# EAGLE schematic meio (EAGLE 9.6.2)
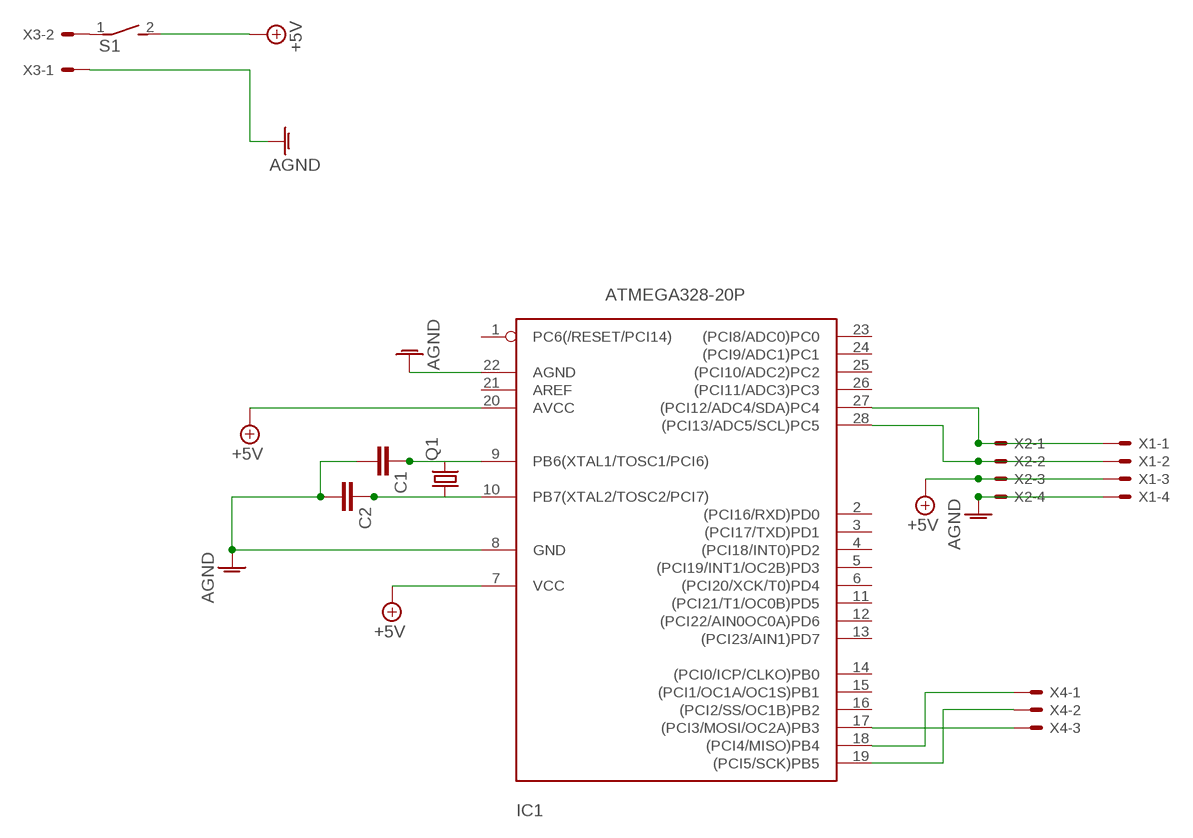
[diagram p0: schematic, sheet 1]

## Parts
C1  C-EU025-025X050  [C025-025X050]
C2  C-EU025-025X050  [C025-025X050]
IC1  ATMEGA328-20P  [DIL28-3]
Q1  CRYSTALHC49S  [HC49/S]
S1  DS01E  [DS-01]
X1  KK-156-4  [KK-156-4]
X2  KK-156-4  [KK-156-4]
X3  KK-156-2  [KK-156-2]
X4  KK-156-3  [KK-156-3]

## Nets
+5V: IC1.7(VCC) IC1.20(AVCC) S1.2 X1.3 X2.3
AGND: C1.2 C2.2 IC1.8(GND) IC1.22(AGND) X1.4 X2.4 X3.1
N$1: C1.1 IC1.9(PB6(XTAL1/TOSC1/PCI6)) Q1.2
N$2: C2.1 IC1.10(PB7(XTAL2/TOSC2/PCI7)) Q1.1
N$3: IC1.27((PCI12/ADC4/SDA)PC4) X1.1 X2.1
N$4: IC1.28((PCI13/ADC5/SCL)PC5) X1.2 X2.2
N$5: S1.1 X3.2
N$6: IC1.18((PCI4/MISO)PB4) X4.1
N$7: IC1.19((PCI5/SCK)PB5) X4.2
N$8: IC1.17((PCI3/MOSI/OC2A)PB3) X4.3
Unconnected: IC1.1(PC6(/RESET/PCI14)) IC1.2((PCI16/RXD)PD0) IC1.3((PCI17/TXD)PD1) IC1.4((PCI18/INT0)PD2) IC1.5((PCI19/INT1/OC2B)PD3) IC1.6((PCI20/XCK/T0)PD4) IC1.11((PCI21/T1/OC0B)PD5) IC1.12((PCI22/AIN0OC0A)PD6) IC1.13((PCI23/AIN1)PD7) IC1.14((PCI0/ICP/CLKO)PB0) IC1.15((PCI1/OC1A/OC1S)PB1) IC1.16((PCI2/SS/OC1B)PB2) IC1.21(AREF) IC1.23((PCI8/ADC0)PC0) IC1.24((PCI9/ADC1)PC1) IC1.25((PCI10/ADC2)PC2) IC1.26((PCI11/ADC3)PC3)

## Library data of the parts
C1 C2 = rcl:C-EU: CAPACITOR, European symbol; SPICEPREFIX: C
IC1 = ATMEGA328P:ATMEGA328*P: MICROCONTROLLER 32 kBytes FLASH 2 kBytes SRAM 1 kBytes EEPROM USART 8-channel 10 bit ADC
Q1 = crystal:CRYSTAL: CRYSTAL; OC_FARNELL: 1667008; OC_NEWARK: unknown
S1 = switch-dil:DS01E: DIL/CODE SWITCH; OC_FARNELL: unknown; OC_NEWARK: unknown
X1 X2 = con-molex:KK-156-4: KK 156 HEADER Source: http://www.molex.com/pdm_docs/sd/026604100_sd.pdf; MF: MOLEX; OC_FARNELL: unknown; OC_NEWARK: unknown
X3 = con-molex:KK-156-2: KK 156 HEADER Source: http://www.molex.com/pdm_docs/sd/026604100_sd.pdf; MF: MOLEX; OC_FARNELL: unknown; OC_NEWARK: unknown
X4 = con-molex:KK-156-3: KK 156 HEADER Source: http://www.molex.com/pdm_docs/sd/026604100_sd.pdf; MF: MOLEX; OC_FARNELL: unknown; OC_NEWARK: unknown